# Altium schematic sheet Mainboard_Power_Interface.SchDoc
size A4
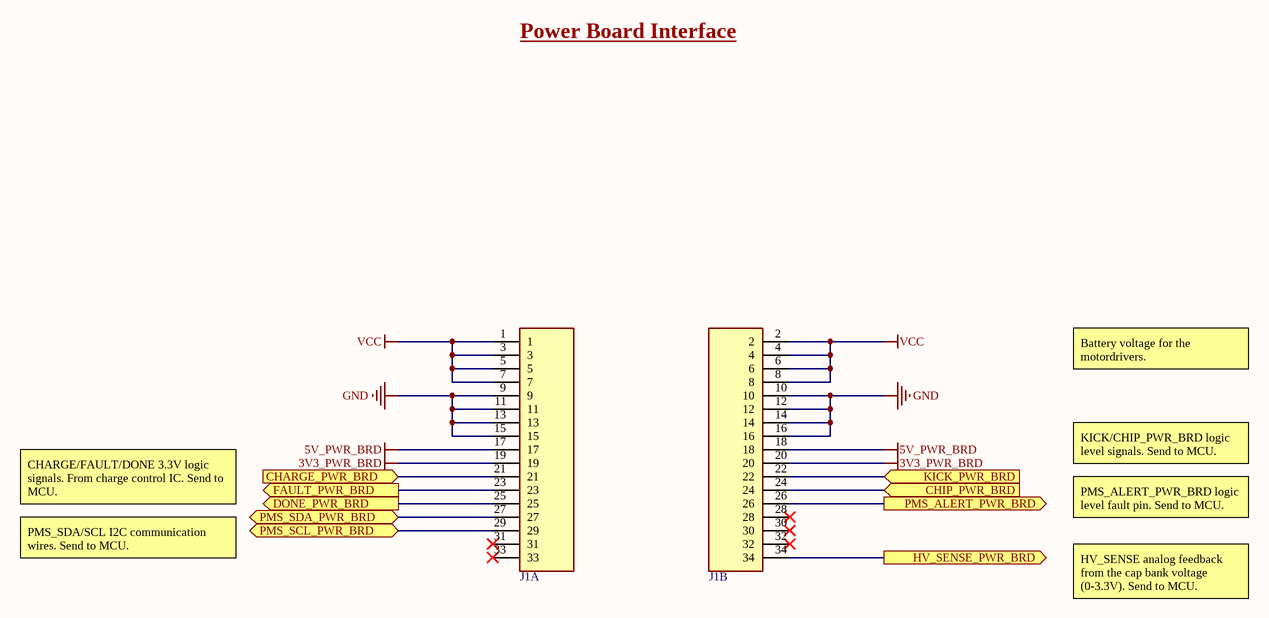
[diagram p0: Mainboard_Power_Interface.SchDoc]

## Parts
J1  0.1" Header Female 34  [SAMTEC-SSM-117-X-DV]  (value not drawn)  (parts A,B of 2)

## Ports
CHARGE_PWR_BRD (in), CHIP_PWR_BRD (in), DONE_PWR_BRD (out), FAULT_PWR_BRD (out), HV_SENSE_PWR_BRD (out), KICK_PWR_BRD (in), PMS_ALERT_PWR_BRD (out), PMS_SCL_PWR_BRD (bidir), PMS_SDA_PWR_BRD (bidir)

## Nets
3V3_PWR_BRD: J1.19 J1.20
5V_PWR_BRD: J1.17 J1.18
GND: J1.9 J1.10 J1.11 J1.12 J1.13 J1.14 J1.15 J1.16
VCC: J1.1 J1.2 J1.3 J1.4 J1.5 J1.6 J1.7 J1.8
CHARGE_PWR_BRD: J1.21 ; port CHARGE_PWR_BRD
CHIP_PWR_BRD: J1.24 ; port CHIP_PWR_BRD
DONE_PWR_BRD: J1.25 ; port DONE_PWR_BRD
FAULT_PWR_BRD: J1.23 ; port FAULT_PWR_BRD
HV_SENSE_PWR_BRD: J1.34 ; port HV_SENSE_PWR_BRD
KICK_PWR_BRD: J1.22 ; port KICK_PWR_BRD
PMS_ALERT_PWR_BRD: J1.26 ; port PMS_ALERT_PWR_BRD
PMS_SCL_PWR_BRD: J1.29 ; port PMS_SCL_PWR_BRD
PMS_SDA_PWR_BRD: J1.27 ; port PMS_SDA_PWR_BRD

Not connected (* = marked no-connect by the designer): J1 28* 30* 31* 32* 33*

## Notes on the sheet
- Power Board Interface
- Battery voltage for the motordrivers.
- KICK/CHIP_PWR_BRD logic level signals. Send to MCU.
- CHARGE/FAULT/DONE 3.3V logic signals. From charge control IC. Send to MCU.
- PMS_ALERT_PWR_BRD logic level fault pin. Send to MCU.
- PMS_SDA/SCL I2C communication wires. Send to MCU.
- HV_SENSE analog feedback from the cap bank voltage (0-3.3V). Send to MCU.

## Library data of the parts
J1 = CN HDR 34POS 2x17: Female Header THRU 34POS 2ROW 0.1" (2.54mm) pitch